# Altium schematic sheet Linelance_Schematic_page2.SchDoc
size A4; Author: Dubatouka U.V.; Address1: Address1; Address2: Address2; Address3: Address3; Address4: Address4; DocumentNumber: 2; SheetNumber: 2; SheetTotal: 3; Scale: 1:1; DocumentType: Схема электрическая принципиальная; FirstReferrence: АБВГ.123456.001
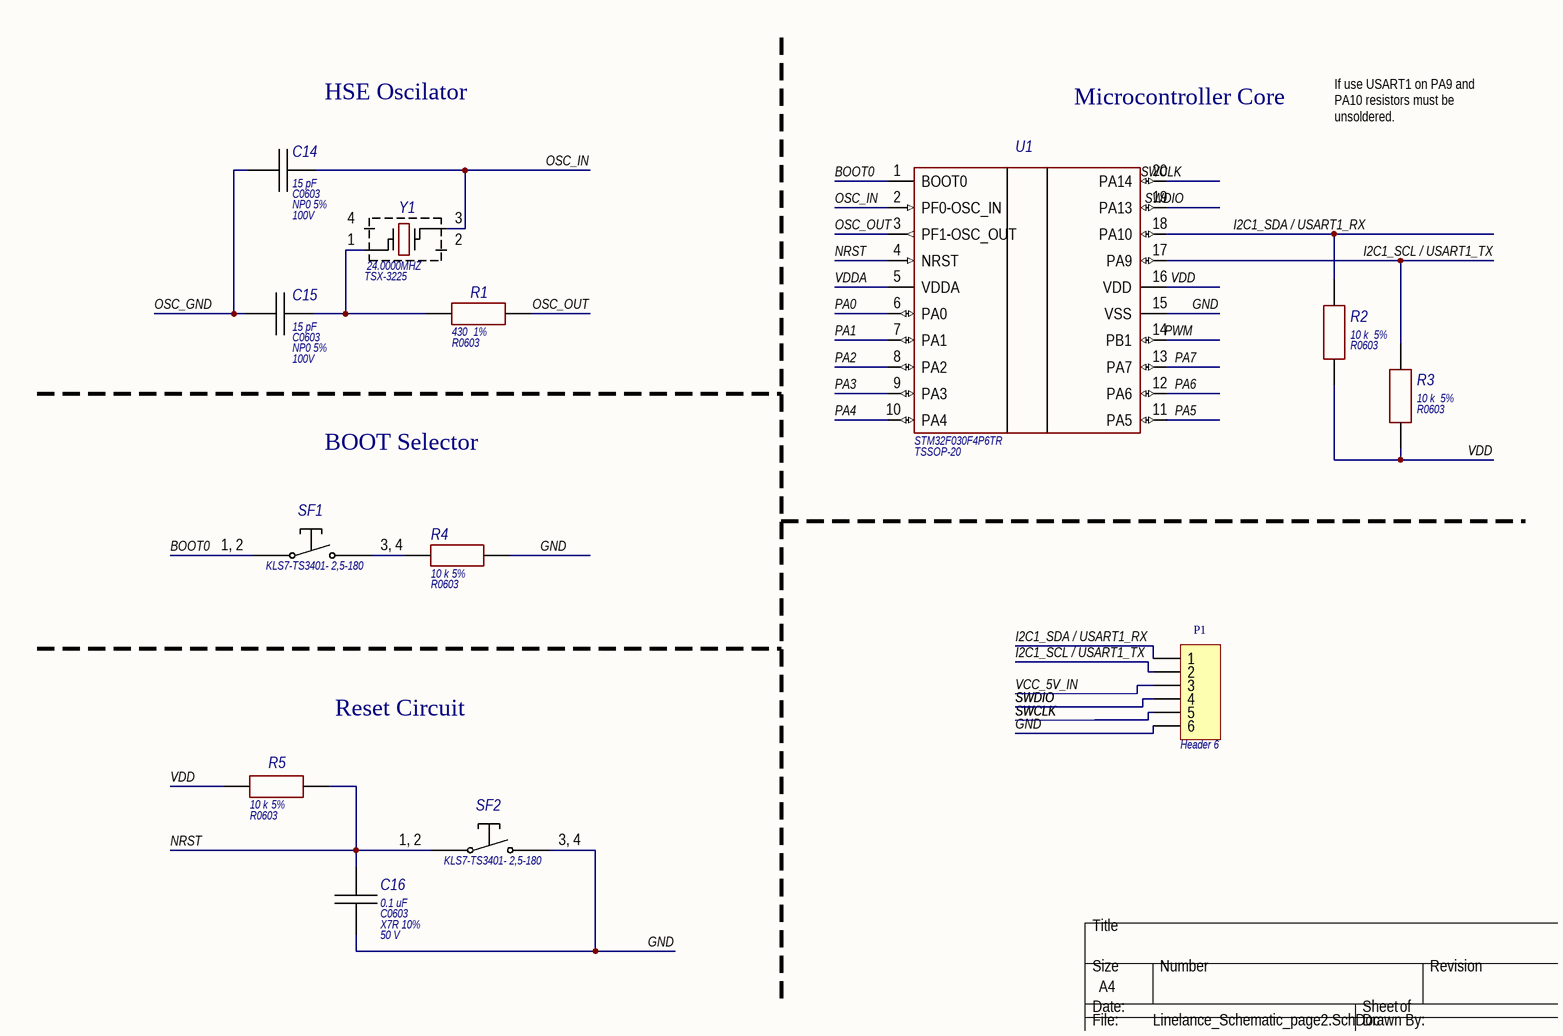
[diagram p0: Linelance_Schematic_page2.SchDoc]

## Parts
C14  Case: С0603  Model: NP0 5%  Voltage: 100V  [C0603]  (hidden comment: 15 pF)
C15  Case: С0603  Model: NP0 5%  Voltage: 100V  [C0603]  (hidden comment: 15 pF)
C16  Model: X7R 10%  Voltage: 50 V  [C0603]  (hidden comment: 0.1 uF)
P1  Header 6  [HDR1X6]
R1  value 430  Model: 1%  [R0603]
R2  value 10 k  Model: 5%  [R0603]
R3  value 10 k  Model: 5%  [R0603]
R4  value 10 k  Model: 5%  [R0603]
R5  value 10 k  Model: 5%  [R0603]
SF1  KLS7-TS3401- 2,5-180  [KMR221GLFS]
SF2  KLS7-TS3401- 2,5-180  [KMR221GLFS]
U1  Model: STM32F030F4P6TR  [TSSOP-20]  (hidden comment: STM32F030F4P6)
Y1  24.0000MHZ  [TSX-3225]

## Nets
BOOT0: SF1.1,_2 U1.1(BOOT0)
GND: C16.2 P1.6 R4.2 SF2.3,_4 U1.15(VSS)
I2C1_SCL / USART1_TX: P1.2 R3.2 U1.17(PA9)
I2C1_SDA / USART1_RX: P1.1 R2.2 U1.18(PA10)
NRST: C16.1 R5.2 SF2.1,_2 U1.4(NRST)
OSC_GND: C14.2 C15.2
OSC_IN: C14.1 U1.2(PF0-OSC_IN) Y1.3
OSC_OUT: R1.2 U1.3(PF1-OSC_OUT)
PA0: U1.6(PA0)
PA1: U1.7(PA1)
PA2: U1.8(PA2)
PA3: U1.9(PA3)
PA4: U1.10(PA4)
PA5: U1.11(PA5)
PA6: U1.12(PA6)
PA7: U1.13(PA7)
PWM: U1.14(PB1)
SWCLK: P1.5 U1.20(PA14)
SWDIO: P1.4 U1.19(PA13)
VCC_5V_IN: P1.3
VDD: R2.1 R3.1 R5.1 U1.16(VDD)
VDDA: U1.5(VDDA)
NetC15_1: C15.1 R1.1 Y1.1
NetR4_1: R4.1 SF1.3,_4

Not connected (* = marked no-connect by the designer): Y1 2 4

## Notes on the sheet
- HSE Oscilator
- Microcontroller Core
- If use USART1 on PA9 and PA10 resistors must be unsoldered.
- BOOT Selector
- Reset Circuit
- Перв. примен.
- Справ. №
- Подп. и дата
- Инв. № дубл.
- Взам. инв. №
- Разраб.
- Изм.
- Лист
- № докум.
- Подп.
- Дата
- Лит.
- Масса
- Масштаб
- Пров.
- Т.контр.
- Листов
- Инв. № подл.
- Утв.
- Н.контр.
- 2.106-A3
- Копировал
- Формат А3

## Library data of the parts
C14-C16 = Capasitor_ceramic: Manufacturer: Murata Manufacturing
  C14 C15: Value: 15 pF; HelpURL: https://www.chipdip.by/product/grm1885c2a150j
  C16: Value: 0.1 uF; Case: C0603; HelpURL: https://www.chipdip.by/product/grm188r71h104k
P1 = Header 6: Header, 6-Pin; LatestRevisionDate: 17-Jul-2002; LatestRevisionNote: Re-released for DXP Platform.; Publisher: Altium Limited
R1-R5 = Resistor: Rext.; Case: R0603; Manufacturer: -
  R1: HelpURL: https://www.chipdip.by/product0/9000079667
  R2-R5: HelpURL: https://www.chipdip.by/product0/65097
SF1 SF2 = Button: SWITCH TACTILE SPST-NO 0.05A 32V; Manufacturer: KLS electronic co ltd; HelpURL: https://www.chipdip.by/product/kls7-ts3401-2-5-180-tvaf11; Model: KLS7-TS3401- 2,5-180; Case: KLS7-TS3401
U1 = STM32F030F4P6: IC MCU 32BIT 16KB FLASH 20TSSOP; Manufacturer: STMicroelectronics; Case: TSSOP-20; HelpURL: https://www.chipdip.by/product/stm32f030f4p6
Y1 = Crystal: CRYSTAL 24.0000MHZ 9PF SMD; Manufacturer: EPSON; Model: TSX-3225 24.0000MF20G-AC0; HelpURL: https://www.digikey.com/product-detail/en/epson/TSX-3225-24-0000MF20G-AC0/SER4185TR-ND/2819192; Case: TSX-3225; Value: 24.0000MHZ